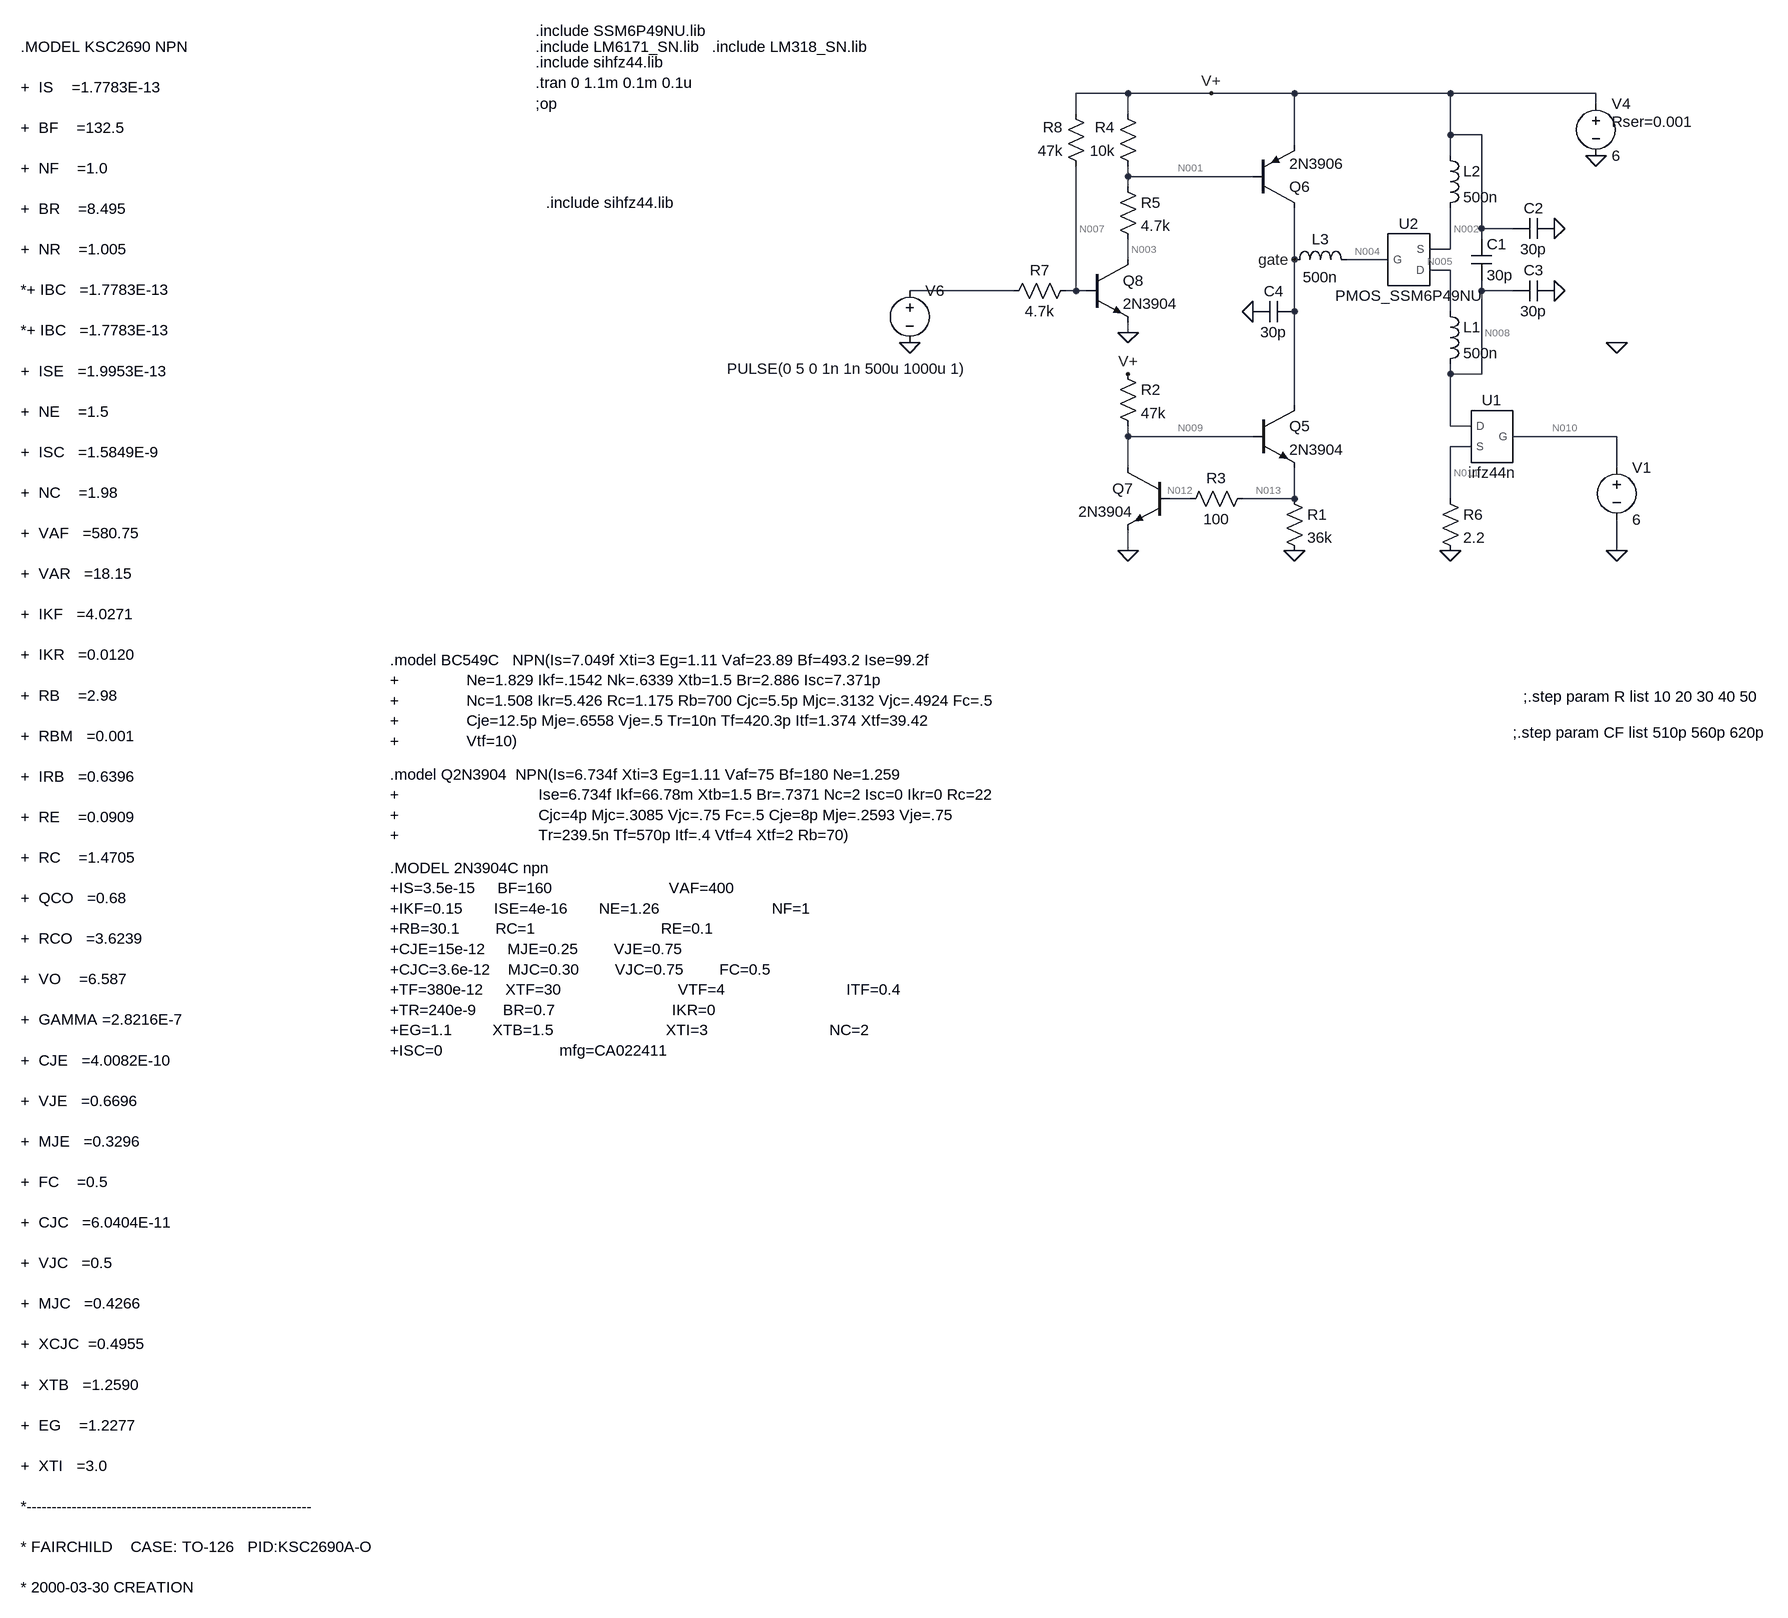
[diagram p0: schematic PFETchar2.asc]
PFETchar2.asc, the LTspice schematic file:
Version 4
SHEET 1 2640 1060
WIRE -160 -400 -240 -400
WIRE -32 -400 -160 -400
WIRE 96 -400 -32 -400
WIRE 336 -400 96 -400
WIRE 560 -400 336 -400
WIRE 560 -384 560 -400
WIRE -240 -368 -240 -400
WIRE -160 -368 -160 -400
WIRE 336 -336 336 -400
WIRE 384 -336 336 -336
WIRE 96 -320 96 -400
WIRE 336 -304 336 -336
WIRE -160 -272 -160 -288
WIRE 32 -272 -160 -272
WIRE -160 -256 -160 -272
WIRE 384 -192 384 -336
WIRE 432 -192 384 -192
WIRE 384 -176 384 -192
WIRE 336 -160 336 -224
WIRE 336 -160 304 -160
WIRE -160 -144 -160 -176
WIRE 96 -144 96 -224
WIRE 240 -144 176 -144
WIRE 336 -128 304 -128
WIRE -336 -96 -496 -96
WIRE -240 -96 -240 -288
WIRE -240 -96 -256 -96
WIRE -224 -96 -240 -96
WIRE 384 -96 384 -112
WIRE 432 -96 384 -96
WIRE 96 -64 96 -144
WIRE 336 -64 336 -128
WIRE -160 -32 -160 -48
WIRE 336 32 336 16
WIRE 384 32 384 -96
WIRE 384 32 336 32
WIRE 96 80 96 -64
WIRE 336 112 336 32
WIRE 368 112 336 112
WIRE -160 128 -160 112
WIRE 32 128 -160 128
WIRE 592 128 432 128
WIRE 368 144 336 144
WIRE -160 176 -160 128
WIRE 592 176 592 128
WIRE -64 224 -96 224
WIRE 96 224 96 176
WIRE 96 224 16 224
WIRE 336 224 336 144
WIRE -160 304 -160 272
WIRE 592 304 592 256
FLAG 96 304 0
FLAG 560 -304 0
FLAG -496 -16 0
FLAG 336 304 0
FLAG 96 -144 gate
FLAG -160 304 0
FLAG -160 32 V+
FLAG -32 -400 V+
FLAG -160 -32 0
FLAG 592 304 0
FLAG 592 -16 0
FLAG 496 -192 0
FLAG 496 -96 0
FLAG 32 -64 0
SYMBOL res 80 208 R0
SYMATTR InstName R1
SYMATTR Value 36k
SYMBOL res 32 208 R90
WINDOW 0 0 56 VBottom 2
WINDOW 3 32 56 VTop 2
SYMATTR InstName R3
SYMATTR Value 100
SYMBOL voltage 560 -400 R0
WINDOW 123 0 0 Left 2
WINDOW 39 24 44 Left 2
SYMATTR SpiceLine Rser=0.001
SYMATTR InstName V4
SYMATTR Value 6
SYMBOL voltage -496 -112 R0
WINDOW 3 -281 136 Left 2
WINDOW 123 0 0 Left 2
WINDOW 39 0 0 Left 2
SYMATTR Value PULSE(0 5 0 1n 1n 500u 1000u 1)
SYMATTR InstName V6
SYMBOL res 320 208 R0
SYMATTR InstName R6
SYMATTR Value 2.2
SYMBOL npn 32 80 R0
SYMATTR InstName Q5
SYMATTR Value 2N3904
SYMBOL pnp 32 -224 M180
SYMATTR InstName Q6
SYMATTR Value 2N3906
SYMBOL res -240 -112 R90
WINDOW 0 0 56 VBottom 2
WINDOW 3 32 56 VTop 2
SYMATTR InstName R7
SYMATTR Value 4.7k
SYMBOL npn -96 176 M0
SYMATTR InstName Q7
SYMATTR Value 2N3904
SYMBOL res -176 16 R0
SYMATTR InstName R2
SYMATTR Value 47k
SYMBOL res -144 -272 R180
WINDOW 0 36 76 Left 2
WINDOW 3 36 40 Left 2
SYMATTR InstName R4
SYMATTR Value 10k
SYMBOL npn -224 -144 R0
SYMATTR InstName Q8
SYMATTR Value 2N3904
SYMBOL res -176 -272 R0
SYMATTR InstName R5
SYMATTR Value 4.7k
SYMBOL res -224 -272 R180
WINDOW 0 36 76 Left 2
WINDOW 3 36 40 Left 2
SYMATTR InstName R8
SYMATTR Value 47k
SYMBOL voltage 592 160 R0
WINDOW 123 0 0 Left 2
WINDOW 39 24 124 Left 2
SYMATTR InstName V1
SYMATTR Value 6
SYMBOL irfz44n 400 128 M0
SYMATTR InstName U1
SYMBOL PMOS_SSM6P49NU 272 -144 R0
SYMATTR InstName U2
SYMBOL ind 320 -80 R0
SYMATTR InstName L1
SYMATTR Value 500n
SYMATTR SpiceLine Rser=0.01
SYMBOL ind 320 -320 R0
SYMATTR InstName L2
SYMATTR Value 500n
SYMATTR SpiceLine Rser=0.01
SYMBOL cap 368 -176 R0
SYMATTR InstName C1
SYMATTR Value 30p
SYMBOL cap 496 -208 R90
WINDOW 0 0 32 VBottom 2
WINDOW 3 32 32 VTop 2
SYMATTR InstName C2
SYMATTR Value 30p
SYMBOL cap 496 -112 R90
WINDOW 0 0 32 VBottom 2
WINDOW 3 32 32 VTop 2
SYMATTR InstName C3
SYMATTR Value 30p
SYMBOL cap 96 -80 R90
WINDOW 0 0 32 VBottom 2
WINDOW 3 32 32 VTop 2
SYMATTR InstName C4
SYMATTR Value 30p
SYMBOL ind 80 -128 R270
WINDOW 0 32 56 VTop 2
WINDOW 3 5 56 VBottom 2
SYMATTR InstName L3
SYMATTR Value 500n
SYMATTR SpiceLine Rser=0.01
TEXT -1072 -384 Left 2 !;op
TEXT -1072 -472 Left 2 !.include LM6171_SN.lib
TEXT -1072 -416 Left 2 !.tran 0 1.1m 0.1m 0.1u
TEXT 432 584 Left 2 !;.step param CF list 510p 560p 620p
TEXT -1072 -448 Left 2 !.include sihfz44.lib
TEXT -1072 -496 Left 2 !.include SSM6P49NU.lib
TEXT 448 528 Left 2 !;.step param R list 10 20 30 40 50
TEXT -800 -472 Left 2 !.include LM318_SN.lib
TEXT -1296 472 Left 2 !.model BC549C   NPN(Is=7.049f Xti=3 Eg=1.11 Vaf=23.89 Bf=493.2 Ise=99.2f\n+               Ne=1.829 Ikf=.1542 Nk=.6339 Xtb=1.5 Br=2.886 Isc=7.371p\n+               Nc=1.508 Ikr=5.426 Rc=1.175 Rb=700 Cjc=5.5p Mjc=.3132 Vjc=.4924 Fc=.5\n+               Cje=12.5p Mje=.6558 Vje=.5 Tr=10n Tf=420.3p Itf=1.374 Xtf=39.42\n+               Vtf=10)
TEXT -1296 648 Left 2 !.model Q2N3904  NPN(Is=6.734f Xti=3 Eg=1.11 Vaf=75 Bf=180 Ne=1.259\n+                               Ise=6.734f Ikf=66.78m Xtb=1.5 Br=.7371 Nc=2 Isc=0 Ikr=0 Rc=22\n+                               Cjc=4p Mjc=.3085 Vjc=.75 Fc=.5 Cje=8p Mje=.2593 Vje=.75\n+                               Tr=239.5n Tf=570p Itf=.4 Vtf=4 Xtf=2 Rb=70)
TEXT -1296 792 Left 2 !.MODEL 2N3904C npn\n+IS=3.5e-15     BF=160                          VAF=400\n+IKF=0.15       ISE=4e-16       NE=1.26                         NF=1\n+RB=30.1        RC=1                            RE=0.1\n+CJE=15e-12     MJE=0.25        VJE=0.75\n+CJC=3.6e-12    MJC=0.30        VJC=0.75        FC=0.5\n+TF=380e-12     XTF=30                          VTF=4                           ITF=0.4\n+TR=240e-9      BR=0.7                          IKR=0\n+EG=1.1         XTB=1.5                         XTI=3                           NC=2\n+ISC=0                          mfg=CA022411
TEXT -1864 -472 Left 2 !.MODEL KSC2690 NPN\n\n+  IS    =1.7783E-13      \n\n+  BF    =132.5\n\n+  NF    =1.0 \n\n+  BR    =8.495\n\n+  NR    =1.005\n\n*+ IBC   =1.7783E-13 \n\n*+ IBC   =1.7783E-13 \n\n+  ISE   =1.9953E-13\n\n+  NE    =1.5\n\n+  ISC   =1.5849E-9\n\n+  NC    =1.98\n\n+  VAF   =580.75\n\n+  VAR   =18.15\n\n+  IKF   =4.0271\n\n+  IKR   =0.0120\n\n+  RB    =2.98\n\n+  RBM   =0.001\n\n+  IRB   =0.6396\n\n+  RE    =0.0909\n\n+  RC    =1.4705\n\n+  QCO   =0.68\n\n+  RCO   =3.6239\n\n+  VO    =6.587\n\n+  GAMMA =2.8216E-7\n\n+  CJE   =4.0082E-10\n\n+  VJE   =0.6696\n\n+  MJE   =0.3296\n\n+  FC    =0.5\n\n+  CJC   =6.0404E-11\n\n+  VJC   =0.5\n\n+  MJC   =0.4266\n\n+  XCJC  =0.4955   \n\n+  XTB   =1.2590    \n\n+  EG    =1.2277 \n\n+  XTI   =3.0         \n\n*---------------------------------------------------------\n\n* FAIRCHILD    CASE: TO-126   PID:KSC2690A-O\n\n* 2000-03-30 CREATION
TEXT -1056 -232 Left 2 !.include sihfz44.lib

The netlist it stands for:
* PFETchar2.asc
R1 N013 0 36k
R3 N013 N012 100
V4 V+ 0 6 Rser=0.001
V6 N006 0 PULSE(0 5 0 1n 1n 500u 1000u 1)
R6 N011 0 2.2
Q5 gate N009 N013 0 2N3904
Q6 gate N001 V+ 0 2N3906
R7 N007 N006 4.7k
Q7 N009 N012 0 0 2N3904
R2 V+ N009 47k
R4 N001 V+ 10k
Q8 N003 N007 0 0 2N3904
R5 N001 N003 4.7k
R8 N007 V+ 47k
V1 N010 0 6
XU1 N008 N010 N011 irfz44n  ; pins D G S
XU2 N005 N004 N002 PMOS_SSM6P49NU  ; pins D G S
L1 N005 N008 500n Rser=0.01
L2 V+ N002 500n Rser=0.01
C1 V+ N008 30p
C2 0 V+ 30p
C3 0 N008 30p
C4 gate 0 30p
L3 gate N004 500n Rser=0.01
.model NPN NPN
.model PNP PNP
.lib standard.bjt
;op
.include LM6171_SN.lib
.tran 0 1.1m 0.1m 0.1u
;.step param CF list 510p 560p 620p
.include sihfz44.lib
.include SSM6P49NU.lib
;.step param R list 10 20 30 40 50
.include LM318_SN.lib
.model BC549C   NPN(Is=7.049f Xti=3 Eg=1.11 Vaf=23.89 Bf=493.2 Ise=99.2f
+               Ne=1.829 Ikf=.1542 Nk=.6339 Xtb=1.5 Br=2.886 Isc=7.371p
+               Nc=1.508 Ikr=5.426 Rc=1.175 Rb=700 Cjc=5.5p Mjc=.3132 Vjc=.4924 Fc=.5
+               Cje=12.5p Mje=.6558 Vje=.5 Tr=10n Tf=420.3p Itf=1.374 Xtf=39.42
+               Vtf=10)
.model Q2N3904  NPN(Is=6.734f Xti=3 Eg=1.11 Vaf=75 Bf=180 Ne=1.259
+                               Ise=6.734f Ikf=66.78m Xtb=1.5 Br=.7371 Nc=2 Isc=0 Ikr=0 Rc=22
+                               Cjc=4p Mjc=.3085 Vjc=.75 Fc=.5 Cje=8p Mje=.2593 Vje=.75
+                               Tr=239.5n Tf=570p Itf=.4 Vtf=4 Xtf=2 Rb=70)
.MODEL 2N3904C npn
+IS=3.5e-15     BF=160                          VAF=400
+IKF=0.15       ISE=4e-16       NE=1.26                         NF=1
+RB=30.1        RC=1                            RE=0.1
+CJE=15e-12     MJE=0.25        VJE=0.75
+CJC=3.6e-12    MJC=0.30        VJC=0.75        FC=0.5
+TF=380e-12     XTF=30                          VTF=4                           ITF=0.4
+TR=240e-9      BR=0.7                          IKR=0
+EG=1.1         XTB=1.5                         XTI=3                           NC=2
+ISC=0                          mfg=CA022411
.MODEL KSC2690 NPN
+  IS    =1.7783E-13
+  BF    =132.5
+  NF    =1.0
+  BR    =8.495
+  NR    =1.005
*+ IBC   =1.7783E-13
*+ IBC   =1.7783E-13
+  ISE   =1.9953E-13
+  NE    =1.5
+  ISC   =1.5849E-9
+  NC    =1.98
+  VAF   =580.75
+  VAR   =18.15
+  IKF   =4.0271
+  IKR   =0.0120
+  RB    =2.98
+  RBM   =0.001
+  IRB   =0.6396
+  RE    =0.0909
+  RC    =1.4705
+  QCO   =0.68
+  RCO   =3.6239
+  VO    =6.587
+  GAMMA =2.8216E-7
+  CJE   =4.0082E-10
+  VJE   =0.6696
+  MJE   =0.3296
+  FC    =0.5
+  CJC   =6.0404E-11
+  VJC   =0.5
+  MJC   =0.4266
+  XCJC  =0.4955
+  XTB   =1.2590
+  EG    =1.2277
+  XTI   =3.0
*---------------------------------------------------------
* FAIRCHILD    CASE: TO-126   PID:KSC2690A-O
* 2000-03-30 CREATION
.include sihfz44.lib
.lib sihfz44.lib
.lib O:\SPICE\Projects\SSM6P49NU.lib
.backanno
.end

* Results of the author's LTspice run, read from the files saved beside the schematic
* Operating Point, zero values left out:
*   V(n013) = 591.5 mV
*   V(n012) = 591.5 mV
*   V(v+) = 5.999 V
*   V(n011) = 2.199 V
*   V(gate) = 597.3 mV
*   V(n009) = 1.182 V
*   V(n001) = 5.849 V
*   V(n007) = 545.2 mV
*   V(n003) = 5.779 V
*   V(n010) = 6 V
*   V(n008) = 5.937 V
*   V(n005) = 5.947 V
*   V(n002) = 5.989 V
*   V(n004) = 597.3 mV
*   Ic(Q6) = -8.716 pA
*   Ib(Q6) = 5.088 pA
*   Ie(Q6) = 3.624 pA
*   Ic(Q8) = 14.99 µA
*   Ib(Q8) = 47.48 nA
*   Ie(Q8) = -15.04 µA
*   Ic(Q7) = 85.77 µA
*   Ib(Q7) = 284.3 nA
*   Ie(Q7) = -86.06 µA
*   Ic(Q5) = 5.016 nA
*   Ib(Q5) = 16.71 µA
*   Ie(Q5) = -16.71 µA
*   I(L3) = -5.008 nA
*   I(L2) = 999.7 mA
*   I(L1) = 999.7 mA
*   I(R8) = -116 µA
*   I(R5) = 14.99 µA
*   I(R4) = -14.99 µA
*   I(R2) = 102.5 µA
*   I(R7) = 116 µA
*   I(R6) = 999.7 mA
*   I(R3) = 284.3 nA
*   I(R1) = 16.43 µA
*   I(V6) = 116 µA
*   I(V4) = -999.9 mA
*   Ix(u1:1) = 999.7 mA
*   Ix(u1:3) = -999.7 mA
*   Ix(u2:1) = -999.7 mA
*   Ix(u2:2) = -5.008 nA
*   Ix(u2:3) = 999.7 mA
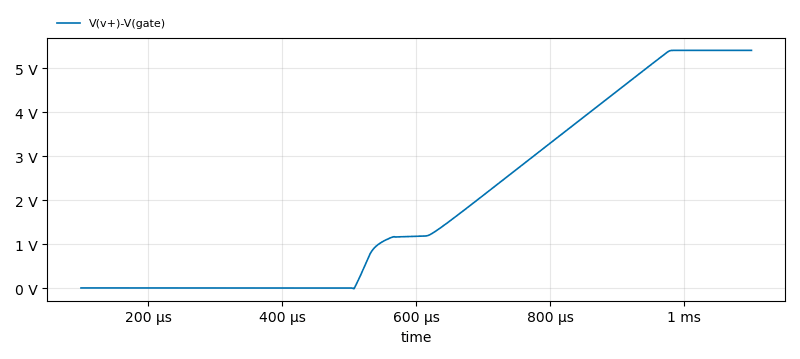
[diagram p1: Transient Analysis of PFETchar2.asc, plotted from the saved traces]
* Transient Analysis, 1 run:
*   V(v+)-V(gate): min -13.49 mV, max 5.402 V, average 1.946 V, rms 2.843 V, last 5.402 V